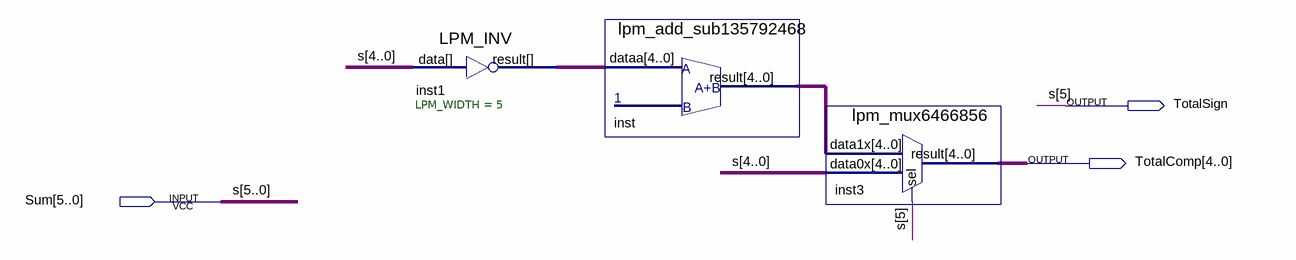
[diagram p0: schematic sheet]
// Quartus schematic ReverseCompl.bdf as structural Verilog: 3 symbols, 3 pins
module ReverseCompl (
  input  [5:0] Sum,
  output TotalSign,
  output [4:0] TotalComp
);

  wire [4:0] inst1_result, inst_result;

  LPM_INV #(.LPM_WIDTH(5)) inst1 (.data(Sum[4:0]), .result(inst1_result));
  lpm_add_sub135792468 inst (.dataa(inst1_result), .result(inst_result));
  lpm_mux6466856 inst3 (.data1x(inst_result), .data0x(Sum[4:0]), .sel(Sum[5]), .result(TotalComp));

  assign TotalSign = Sum[5];

  // Other names for the same wires on the sheet: s[5:0] = Sum
endmodule
